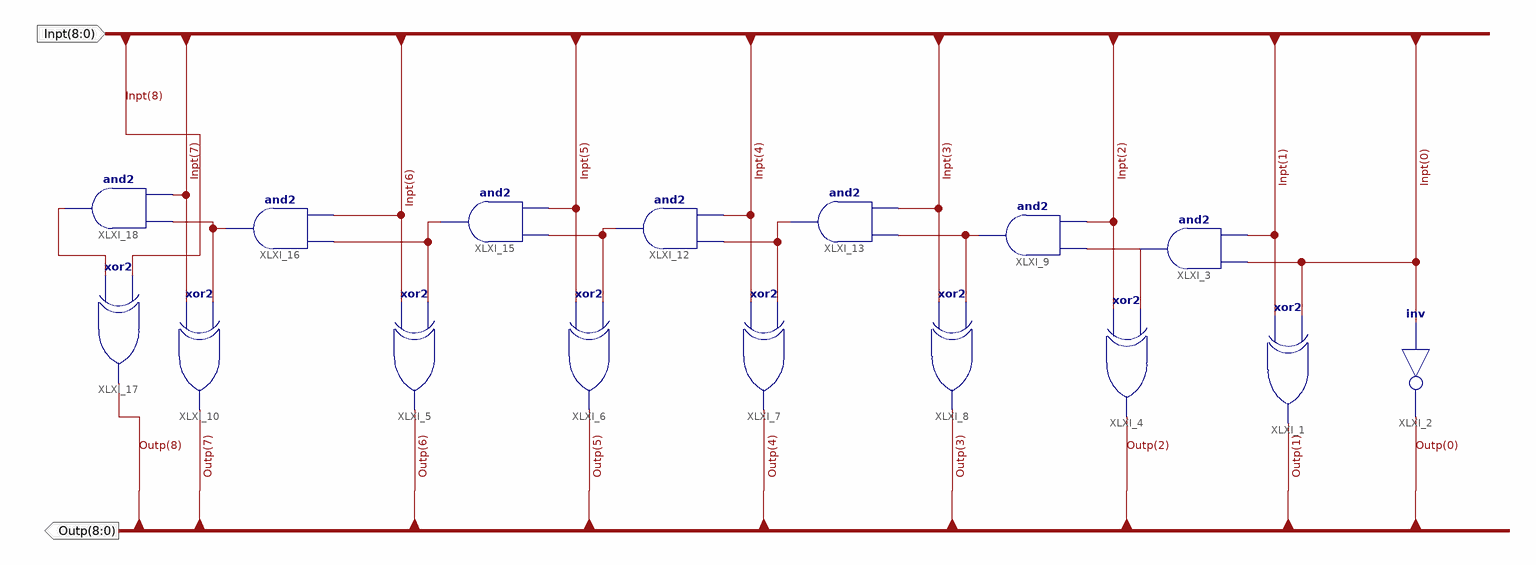
[diagram p0: schematic sheet 1]
// Xilinx ISE schematic increamenter.sch (spartan3e) as structural Verilog: 16 symbols, 2 ports
module increamenter (
  input  [8:0] Inpt,
  output [8:0] Outp
);

  wire XLXN_3, XLXN_5, XLXN_7, XLXN_11, XLXN_14, XLXN_16, XLXN_72;

  xor XLXI_1 (Outp[1], Inpt[1], Inpt[0]);
  not XLXI_2 (Outp[0], Inpt[0]);
  and XLXI_3 (XLXN_3, Inpt[1], Inpt[0]);
  xor XLXI_4 (Outp[2], Inpt[2], XLXN_3);
  xor XLXI_5 (Outp[6], Inpt[6], XLXN_7);
  xor XLXI_6 (Outp[5], Inpt[5], XLXN_11);
  xor XLXI_7 (Outp[4], Inpt[4], XLXN_14);
  xor XLXI_8 (Outp[3], Inpt[3], XLXN_5);
  and XLXI_9 (XLXN_5, Inpt[2], XLXN_3);
  xor XLXI_10 (Outp[7], Inpt[7], XLXN_16);
  and XLXI_15 (XLXN_7, Inpt[5], XLXN_11);
  and XLXI_12 (XLXN_11, Inpt[4], XLXN_14);
  and XLXI_13 (XLXN_14, Inpt[3], XLXN_5);
  and XLXI_16 (XLXN_16, Inpt[6], XLXN_7);
  xor XLXI_17 (Outp[8], XLXN_72, Inpt[8]);
  and XLXI_18 (XLXN_72, Inpt[7], XLXN_16);
endmodule
